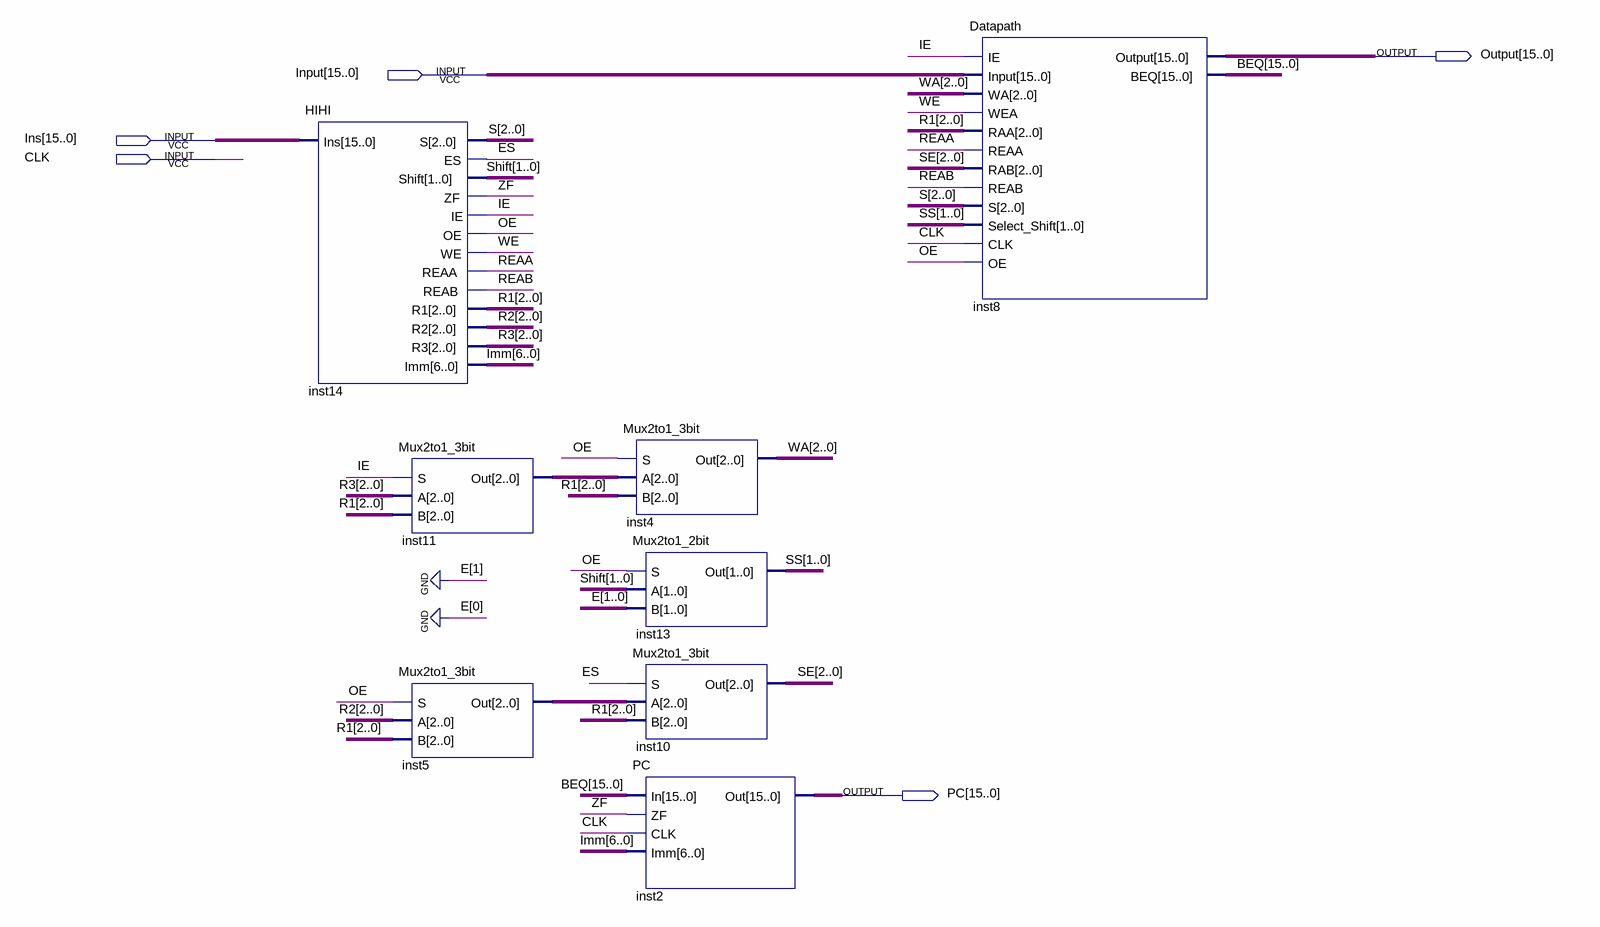
[diagram p0: schematic sheet]
// Quartus schematic MIPS_Processor_Design.bdf as structural Verilog: 8 symbols, 5 pins
module MIPS_Processor_Design (
  input  [15:0] Input,
  input  [15:0] Ins,
  input  CLK,
  output [15:0] Output,
  output [15:0] PC
);

  wire ES, IE, OE, REAA, REAB, WE, ZF;
  wire [1:0] Shift, SS;
  wire [2:0] inst5_out, inst11_out, R1, R2, R3, S, SE, WA;
  wire [6:0] Imm;
  wire [15:0] BEQ;

  HIHI inst14 (
    .Ins(Ins), .S(S), .ES(ES), .Shift(Shift), .ZF(ZF), .IE(IE), .OE(OE), .WE(WE), .REAA(REAA), .REAB(REAB),
    .R1(R1), .R2(R2), .R3(R3), .Imm(Imm));
  Mux2to1_3bit inst11 (.S(IE), .A(R3), .B(R1), .Out(inst11_out));
  Mux2to1_3bit inst5 (.S(OE), .A(R2), .B(R1), .Out(inst5_out));
  Mux2to1_3bit inst4 (.S(OE), .A(inst11_out), .B(R1), .Out(WA));
  Mux2to1_2bit inst13 (.S(OE), .A(Shift), .B(2'b00), .Out(SS));
  Mux2to1_3bit inst10 (.S(ES), .A(inst5_out), .B(R1), .Out(SE));
  PC inst2 (.In(BEQ), .ZF(ZF), .CLK(CLK), .Imm(Imm), .Out(PC));
  Datapath inst8 (
    .IE(IE), .Input(Input), .WA(WA), .WEA(WE), .RAA(R1), .REAA(REAA), .RAB(SE), .REAB(REAB), .S(S),
    .Select_Shift(SS), .CLK(CLK), .OE(OE), .Output(Output), .BEQ(BEQ));
endmodule
